# EAGLE design androino_2009-V1.0 (EAGLE 5.06)
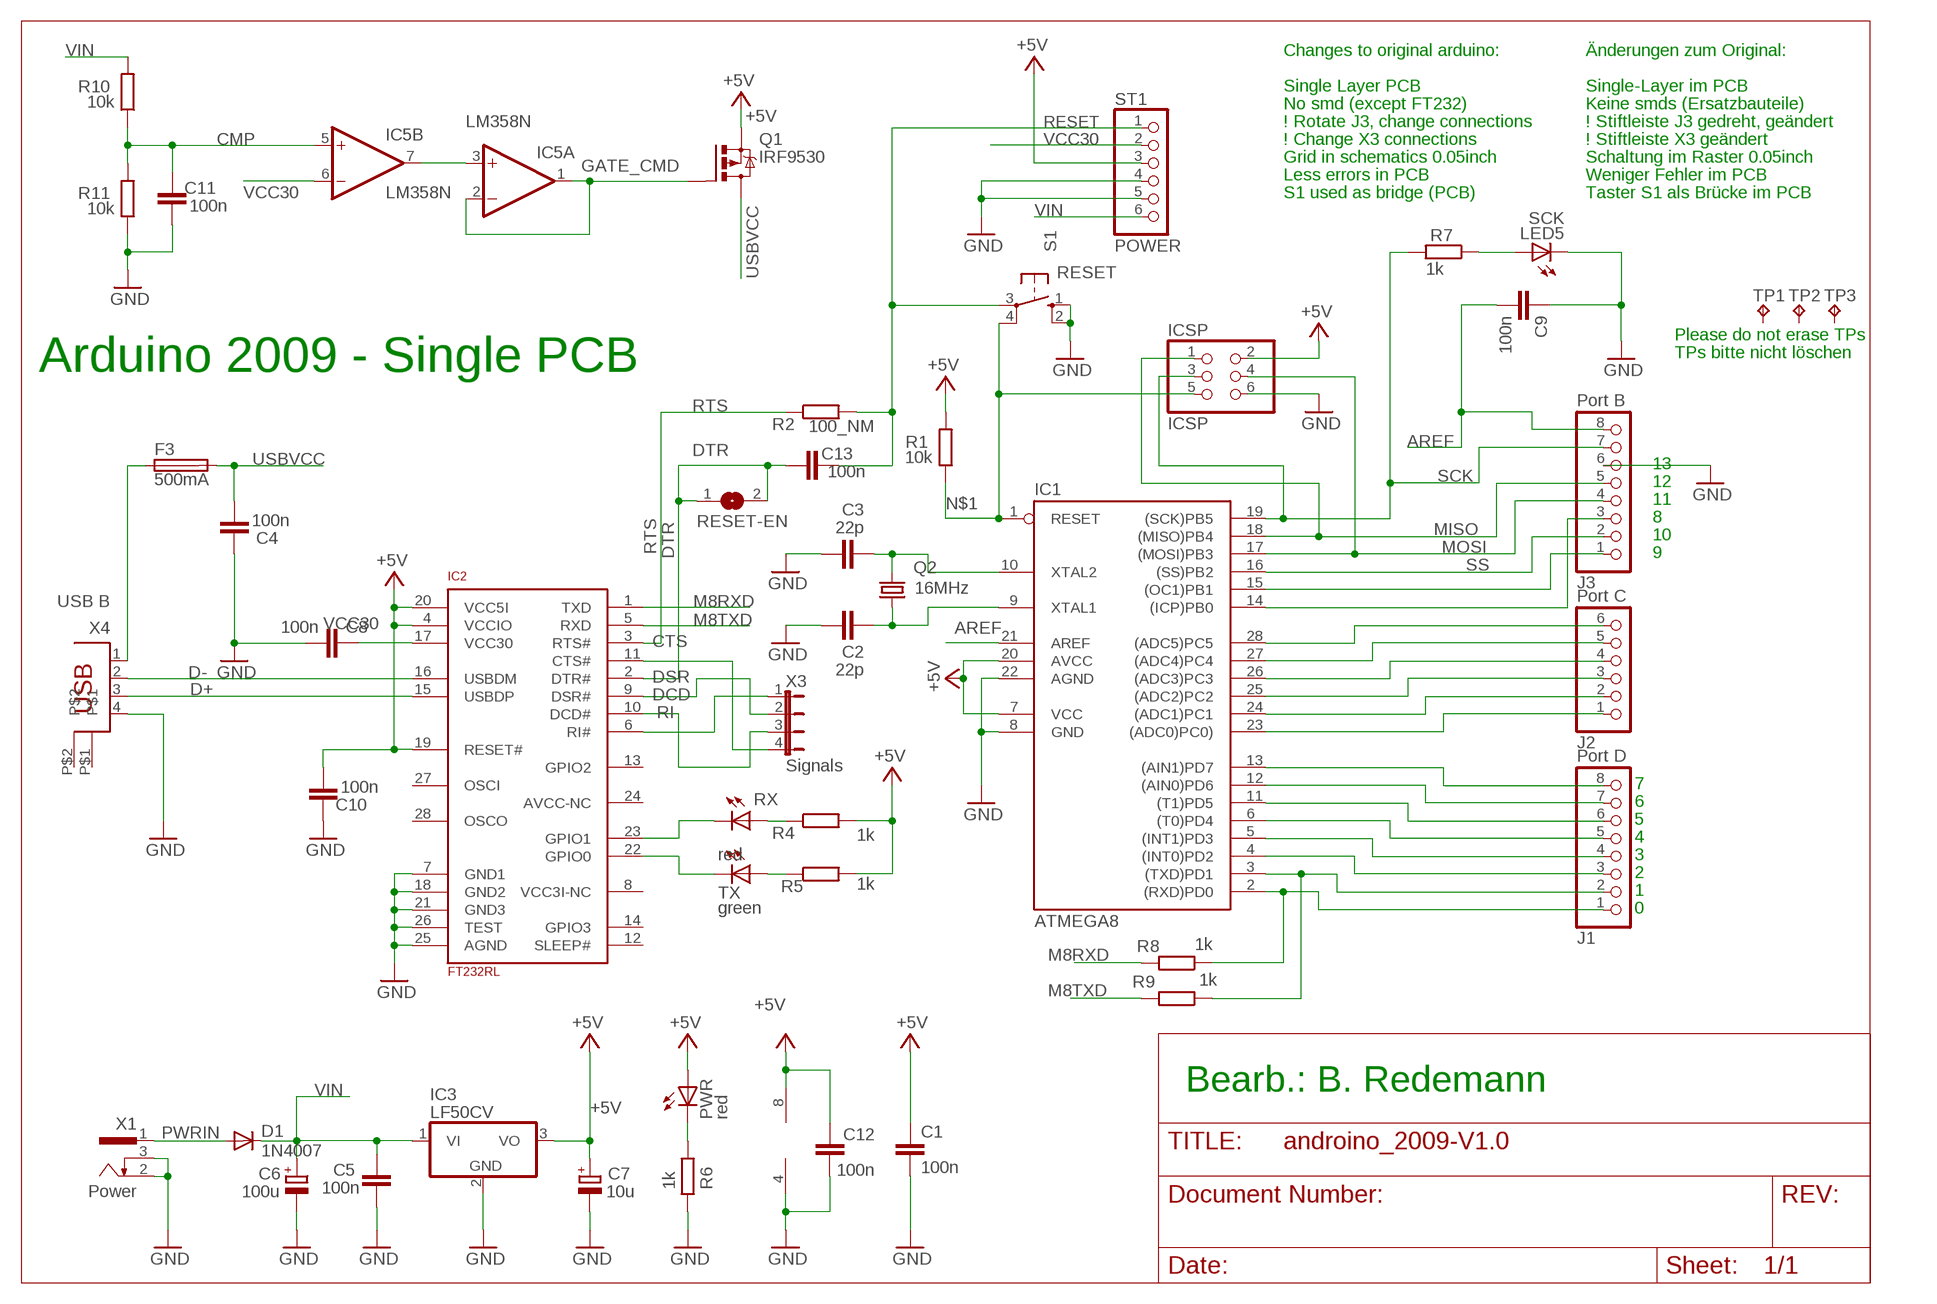
[diagram p0: schematic, sheet 1]

## Parts
C1  100n  C-EU025-024X044  [C025-024X044]
C2  22p  C-EU025-024X044  [C025-024X044]
C3  22p  C-EU025-024X044  [C025-024X044]
C4  100n  C-EU025-024X044  [C025-024X044]
C5  100n  C-EU025-024X044  [C025-024X044]
C6  100u  CPOL-EUE2.5-6  [E2,5-6]
C7  10u  CPOL-EUE2.5-6  [E2,5-6]
C8  100n  C-EU025-024X044  [C025-024X044]
C9  100n  C-EU025-024X044  [C025-024X044]
C10  100n  C-EU025-024X044  [C025-024X044]
C11  100n  C-EU025-024X044  [C025-024X044]
C12  100n  C-EU025-024X044  [C025-024X044]
C13  100n  C-EU025-024X044  [C025-024X044]
D1  1N4007  DIODE-D-7.5  [D-7.5]
F3  500mA  PICOFUSE  [PICOFUSE]
IC1  ATMEGA8  AT90S4433P  [DIL28-3]
IC2  FT232RL  [SSOP28]
IC3  LF50CV  7805TV  [TO220V]
IC5  LM358N  [DIL08]
ICSP  ICSP  PINHD-2X3  [2X03]
J1  Port D  PINHD-1X8  [1X08]
J2  Port C  PINHD-1X6  [1X06]
J3  Port B  PINHD-1X8  [1X08]
LED5  SCK  LED3MM  [LED3MM]
PWR  red  LED3MM  [LED3MM]
Q1  IRF9530  [TO220BV]
Q2  16MHz  CRYTALHC49S  [HC49/S]
R1  10k  R-EU_0204/7  [0204/7]
R2  100_NM  R-EU_0204/7  [0204/7]
R4  1k  R-EU_0204/7  [0204/7]
R5  1k  R-EU_0204/7  [0204/7]
R6  1k  R-EU_0204/7  [0204/7]
R7  1k  R-EU_0204/7  [0204/7]
R8  1k  R-EU_0204/7  [0204/7]
R9  1k  R-EU_0204/7  [0204/7]
R10  10k  R-EU_0204/7  [0204/7]
R11  10k  R-EU_0204/7  [0204/7]
RESET-EN  SJ  [SJ]
RX  red  LED3MM  [LED3MM]
S1  RESET  10-XX  [B3F-10XX]
ST1  POWER  PINHD-1X6  [1X06]
TP1  TPTP06SQ  [TP06SQ]
TP2  TPTP06SQ  [TP06SQ]
TP3  TPTP06SQ  [TP06SQ]
TX  green  LED3MM  [LED3MM]
X1  Power  733980-62  [733980-62]
X3  Signals  JP4E  [JP4]
X4  USB B  PN61729  [PN61729]

## Nets
+5V: C1.1 C7.+ C10.1 C12.2 IC1.7(VCC) IC1.20(AVCC) IC2.4(VCCIO) IC2.19(RESET#) IC2.20(VCC5I) IC3.3(VO) IC5.8(P:V+) ICSP.2 PWR.A Q1.S R1.2 R4.2 R5.2 ST1.3
AREF: C9.2 IC1.21(AREF) J3.8
CMP: C11.2 IC5.5(B:+IN) R10.1 R11.2
CTS: IC2.11(CTS#) X3.4
D+: IC2.15(USBDP) X4.3
D-: IC2.16(USBDM) X4.2
DCD: IC2.10(DCD#) X3.3
DSR: IC2.9(DSR#) X3.2
DTR: C13.1 IC2.2(DTR#) RESET-EN.1 RESET-EN.2
GATE_CMD: IC5.1(A:OUT) IC5.2(A:-IN) Q1.G
GND [gnd]: C1.2 C2.1 C3.1 C4.2 C5.1 C6.- C7.- C8.1 C9.1 C10.2 C11.1 C12.1 IC1.8(GND) IC1.22(AGND) IC2.7(GND1) IC2.18(GND2) IC2.21(GND3) IC2.25(AGND) IC2.26(TEST) IC3.2(GND) IC5.4(P:V-) ICSP.6 J3.6 LED5.K(C) R6.2 R11.1 S1.1(S) S1.2(S1) ST1.4 ST1.5 X1.2 X1.3 X4.4
M8RXD: IC2.1(TXD) R8.2
M8TXD: IC2.5(RXD) R9.2
MISO: IC1.18((MISO)PB4) ICSP.1 J3.5
MOSI: IC1.17((MOSI)PB3) ICSP.4 J3.4
N$1: IC1.1(RESET) ICSP.5 R1.1 S1.4(P1)
N$2: LED5.A R7.1
N$3: PWR.K(C) R6.1
N$6: C2.2 IC1.9(XTAL1) Q2.1
N$7: C3.2 IC1.10(XTAL2) Q2.2
N$8: F3.1 X4.1
N$16: IC1.23((ADC0)PC0)) J2.1
N$17: IC1.24((ADC1)PC1) J2.2
N$18: IC1.25((ADC2)PC2) J2.3
N$19: IC1.26((ADC3)PC3) J2.4
N$20: IC1.27((ADC4)PC4) J2.5
N$21: IC1.28((ADC5)PC5) J2.6
N$28: IC5.3(A:+IN) IC5.7(B:OUT)
N$32: IC2.23(GPIO1) RX.K(C)
N$34: IC2.22(GPIO0) TX.K(C)
N$35: R4.1 RX.A
N$36: R5.1 TX.A
PB0: IC1.14((ICP)PB0) J3.3
PB1: IC1.15((OC1)PB1) J3.1
PD0: IC1.2((RXD)PD0) J1.1 R8.1
PD1: IC1.3((TXD)PD1) J1.2 R9.1
PD2: IC1.4((INT0)PD2) J1.3
PD3: IC1.5((INT1)PD3) J1.4
PD4: IC1.6((T0)PD4) J1.5
PD5: IC1.11((T1)PD5) J1.6
PD6: IC1.12((AIN0)PD6) J1.7
PD7: IC1.13((AIN1)PD7) J1.8
PWRIN: D1.A X1.1
RESET: C13.2 R2.2 S1.3(P) ST1.1
RI: IC2.6(RI#) X3.1
RTS: IC2.3(RTS#) R2.1
SCK: IC1.19((SCK)PB5) ICSP.3 J3.7 R7.2
SS: IC1.16((SS)PB2) J3.2
USBVCC: C4.1 F3.2 Q1.D
VCC30: C8.2 IC2.17(VCC30) IC5.6(B:-IN) ST1.2
VIN: C5.2 C6.+ D1.C IC3.1(VI) R10.2 ST1.6
Unconnected: IC2.8(VCC3I-NC) IC2.12(SLEEP#) IC2.13(GPIO2) IC2.14(GPIO3) IC2.24(AVCC-NC) IC2.27(OSCI) IC2.28(OSCO) TP1.TP TP2.TP TP3.TP X4.P$1 X4.P$2

## Notes on the sheet
- Changes to original arduino: | Änderungen zum Original:
- Single Layer PCB | Single-Layer im PCB
- No smd (except FT232) | Keine smds (Ersatzbauteile)
- ! Rotate J3, change connections | ! Stiftleiste J3 gedreht, geändert
- ! Change X3 connections | ! Stiftleiste X3 geändert
- Grid in schematics 0.05inch | Schaltung im Raster 0.05inch
- Less errors in PCB | Weniger Fehler im PCB
- S1 used as bridge (PCB) | Taster S1 als Brücke im PCB
- Please do not erase TPs
- TPs bitte nicht löschen
- Arduino 2009 - Single PCB
- 13
- 12
- 11
- 8
- 10
- 9
- 7
- 6
- 5
- 4
- 3
- 2
- 1
- 0
- Bearb.: B. Redemann

## Library data of the parts
C1-C5 C8-C13 = rcl:C-EU: CAPACITOR, European symbol
C6 C7 = rcl:CPOL-EU: POLARIZED CAPACITOR, European symbol
D1 = diode:DIODE-: DIODE
F3 = fuse:PICOFUSE: PICOFUSE 19275, Wickmann
IC1 = atmel:AT90S4433: MICROCONTROLLER 4 Kbytes FLASH 128 bytes SRAM 256 bytes EEPROM UART 6-channel 10 bit ADC
IC2 = SmartPrj:FT232RL
IC3 = linear:78*: Positive VOLTAGE REGULATOR Source: http://cache.national.com/ds/LM/LM78L05.pdf http://www.fairchildsemi.com/ds/LM/LM7805.pdf
IC5 = linear:LM358: OP AMP also LM158; LM258; LM2904 Source: http://cache.national.com/ds/LM/LM158.pdf
ICSP = pinhead:PINHD-2X3: PIN HEADER
J1 J3 = pinhead:PINHD-1X8: PIN HEADER
J2 ST1 = pinhead:PINHD-1X6: PIN HEADER
LED5 PWR RX TX = led:LED: LED OSRAM: - CHIPLED LG R971, LG N971, LY N971, LG Q971, LY Q971, LO R971, LY R971 LH N974, LH R974 LS Q976, LO Q976, LY Q976 LO Q996 - Hyper CHIPLED LW Q18S LB Q993, LB Q99A, LB R99A - SideLED LS A670, LO A670, LY A670, LG A670, LP A670 LB A673, LV A673, LT A673, LW A673 LH A674 LY A675 LS A676, LA A676, LO A676, LY A676, LW A676 LS A679, LY A679, LG A679 - Hyper Micro SIDELED® LS Y876, LA Y876, LO Y876, LY Y876 LT Y87S - SmartLED LW L88C, LW L88S LB L89C, LB L89S, LG L890 LS L89K, LO L89K, LY L89K LS L896, LA L896, LO L896, LY L896 - TOPLED LS T670, LO T670, LY T670, LG T670, LP T670 LSG T670, LSP T670, LSY T670, LOP T670, LYG T670 LG T671, LOG T671, LSG T671 LB T673, LV T673, LT T673, LW T673 LH T674 LS T676, LA T676, LO T676, LY T676, LB T676, LH T676, LSB T676, LW T676 LB T67C, LV T67C, LT T67C, LS T67K, LO T67K, LY T67K, LW E67C LS E67B, LA E67B, LO E67B, LY E67B, LB E67C, LV E67C, LT E67C LW T67C LS T679, LY T679, LG T679 LS T770, LO T770, LY T770, LG T770, LP T770 LB T773, LV T773, LT T773, LW T773 LH T774 LS E675, LA E675, LY E675, LS T675 LS T776, LA T776, LO T776, LY T776, LB T776 LHGB T686 LT T68C, LB T68C - Hyper Mini TOPLED® LB M676 - Mini TOPLED Santana® LG M470 LS M47K, LO M47K, LY M47K Source: http://www.osram.convergy.de/
Q1 = transistor-power:IRF9530: P-CHANNEL HEXFET POWER-MOS-FET Source: http://www.irf.com/product-info/datasheets/data/irf9530.pdf
Q2 = crystal:CRYTAL: CRYSTAL
R1 R2 R4-R11 = rcl:R-EU_: RESISTOR, European symbol
RESET-EN = jumper:SJ: SMD solder JUMPER
S1 = switch-omron:10-XX: OMRON SWITCH
TP1-TP3 = testpad:TP: Test pad
X1 = con-conrad:73398?: FEMALE PRINT CONNECTOR Niedervolt-Steckverbinder Distributor Conrad
X3 = jumper:JP4E: JUMPER
X4 = SmartPrj:PN61729: BERG USB connector

## Net classes
0 default: width 0.254 mm, drill 0.305 mm, clearance 0.152 mm
1 power: width 0.61 mm, drill 0.508 mm, clearance 0.152 mm
2 gnd: width 0.305 mm, drill 0.508 mm, clearance 0.152 mm
3 usbvcc: width 0.508 mm, drill 0.508 mm, clearance 0.152 mm
4 aref: width 0.406 mm

## Board
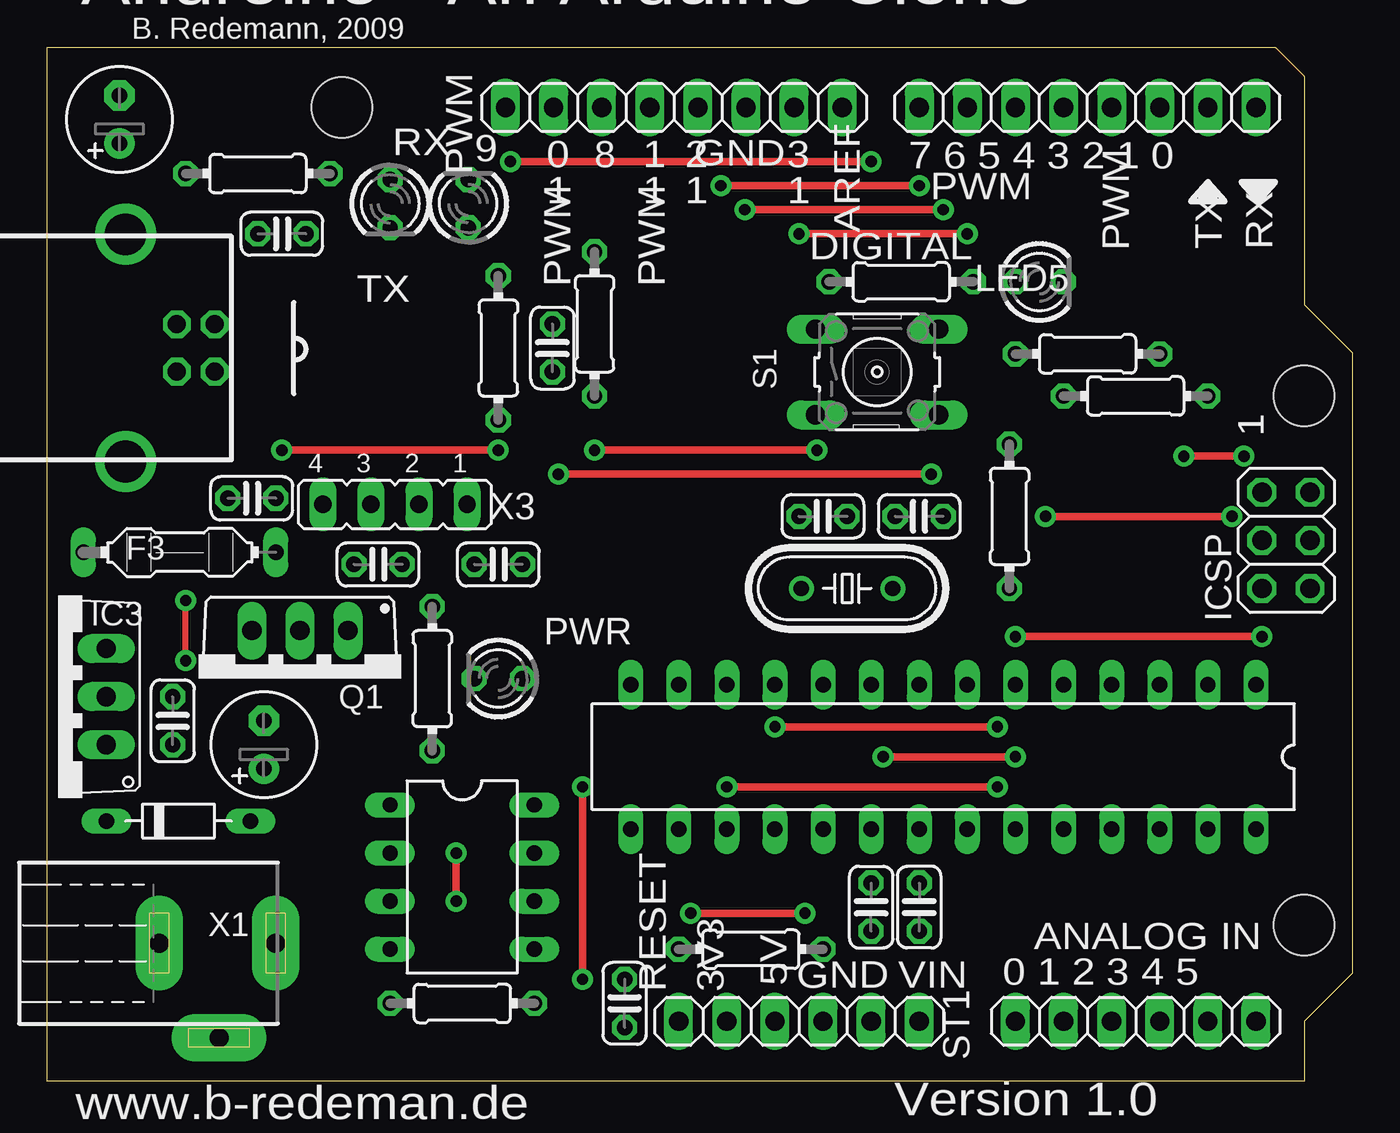
[diagram p1: board, top side]
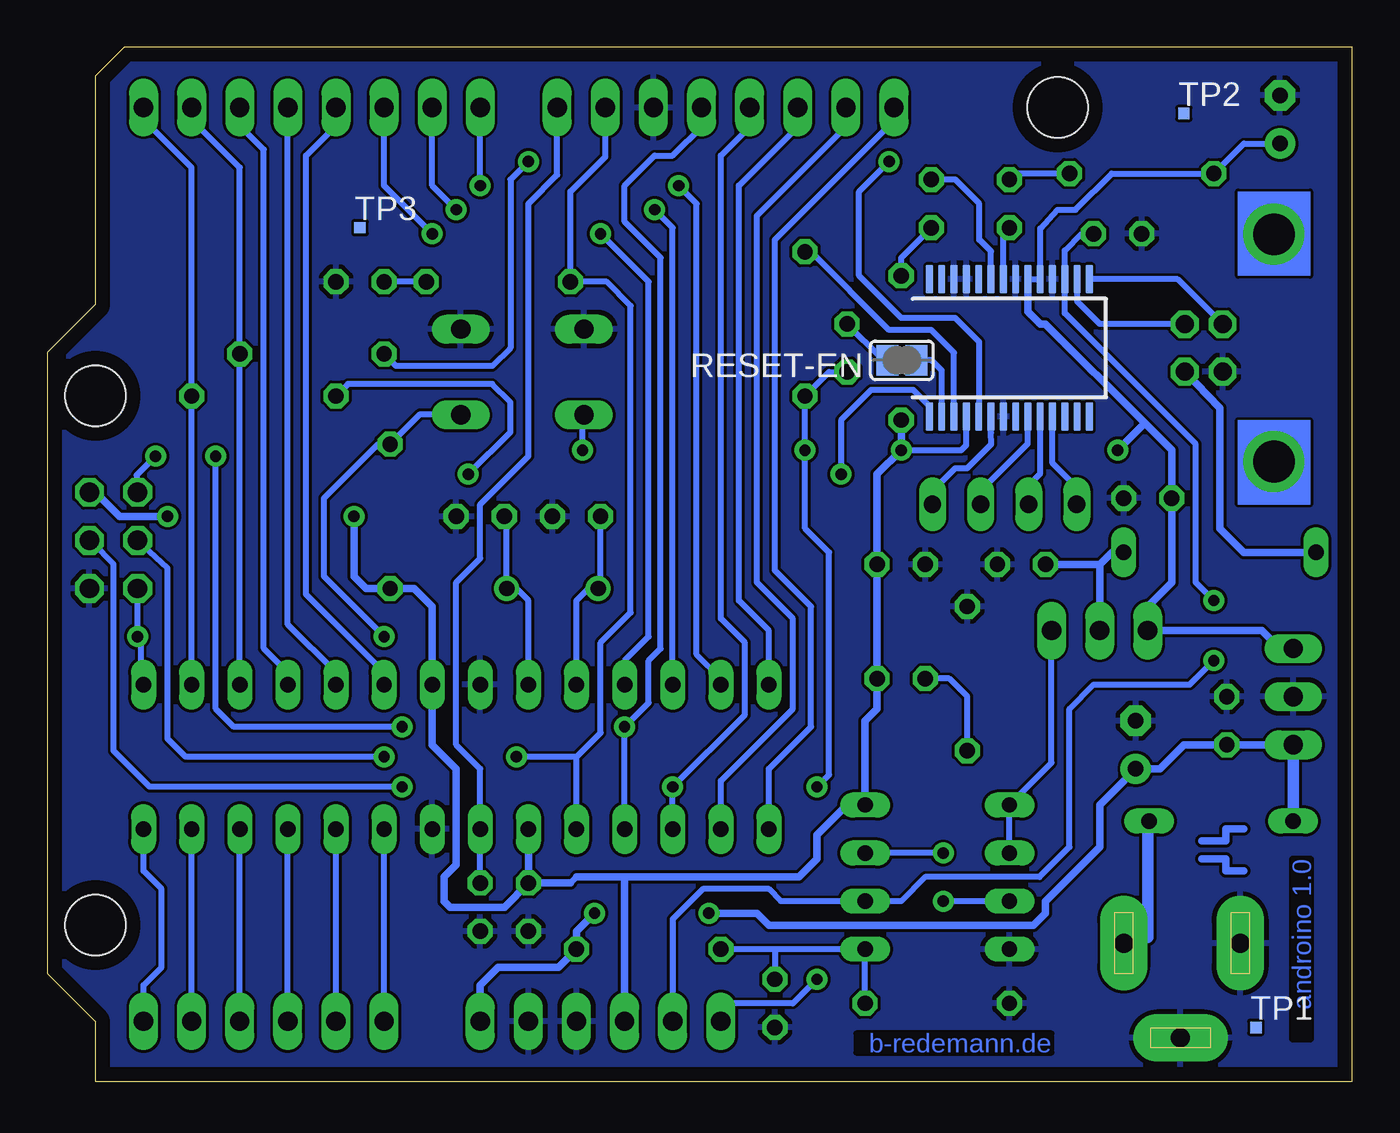
[diagram p2: board, bottom side, seen from below]

Size 68.9 x 54.61 mm. Coordinates in mm from the lower left corner, seen from the top.
Outline: 0,54.61 64.83,54.61 66.36,53.09 66.36,41.02 68.9,38.48 68.9,5.71 66.36,3.17 66.36,0 0,0 0,54.61
Copper layers (1*16): Top 0.035mm / dielectric 1.5mm / Bottom 0.035mm
Design rules "default *": minimum track width 6mil, minimum drill 12mil, track to track 6mil, track to pad 6mil, pad to pad 6mil, via to via 6mil, smd to smd 6mil, copper to edge 30mil, drill to drill 6mil, minimum pad ring 10mil, minimum via ring 10mil, stop-mask expansion 4mil, vias tented up to drill 0mil, thermal gap 10mil
Holes 3.2 mm at 66.36,36.2 66.36,8.26 15.56,51.43

### Footprints (pad centres in the part's own frame; a part is rotated, then mirrored left to right if it is on the bottom)
C025-024X044 = drill 0.813 octagon: 1 -1.27,0; 2 1.27,0
E2,5-6 = drill 0.813 pad 1.6 round: + -1.27,0 | drill 0.813 pad 1.6 octagon: - 1.27,0
D-7.5 = drill 0.813 long: A 3.81,0; C -3.81,0
PICOFUSE = drill 0.813 long: 1 -5.08,0; 2 5.08,0
DIL28-3 = drill 0.813 long: 1 -16.51,-3.81; 2 -13.97,-3.81; 3 -11.43,-3.81; 4 -8.89,-3.81; 5 -6.35,-3.81; 6 -3.81,-3.81; 7 -1.27,-3.81; 8 1.27,-3.81; 9 3.81,-3.81; 10 6.35,-3.81; 11 8.89,-3.81; 12 11.43,-3.81; 13 13.97,-3.81; 14 16.51,-3.81; 15 16.51,3.81; 16 13.97,3.81; 17 11.43,3.81; 18 8.89,3.81; 19 6.35,3.81; 20 3.81,3.81; 21 1.27,3.81; 22 -1.27,3.81; 23 -3.81,3.81; 24 -6.35,3.81; 25 -8.89,3.81; 26 -11.43,3.81; 27 -13.97,3.81; 28 -16.51,3.81
SSOP28 = smd 0.381 x 1.499: 1 -4.225,-3.625; 2 -3.575,-3.625; 3 -2.925,-3.625; 4 -2.275,-3.625; 5 -1.625,-3.625; 6 -0.975,-3.625; 7 -0.325,-3.625; 8 0.325,-3.625; 9 0.975,-3.625; 10 1.625,-3.625; 11 2.275,-3.625; 12 2.925,-3.625; 13 3.575,-3.625; 14 4.225,-3.625; 15 4.225,3.625; 16 3.575,3.625; 17 2.925,3.625; 18 2.275,3.625; 19 1.625,3.625; 20 0.975,3.625; 21 0.325,3.625; 22 -0.325,3.625; 23 -0.975,3.625; 24 -1.625,3.625; 25 -2.275,3.625; 26 -2.925,3.625; 27 -3.575,3.625; 28 -4.225,3.625
TO220V = drill 1.016 long: 1 -2.54,-2.54; 2 0,-2.54; 3 2.54,-2.54
DIL08 = drill 0.813 long: 1 -3.81,-3.81; 2 -1.27,-3.81; 3 1.27,-3.81; 4 3.81,-3.81; 5 3.81,3.81; 6 1.27,3.81; 7 -1.27,3.81; 8 -3.81,3.81
2X03 = drill 1.016 octagon: 1 -2.54,-1.27; 2 -2.54,1.27; 3 0,-1.27; 4 0,1.27; 5 2.54,-1.27; 6 2.54,1.27
1X08 = drill 1.016 long: 1 -8.89,0; 2 -6.35,0; 3 -3.81,0; 4 -1.27,0; 5 1.27,0; 6 3.81,0; 7 6.35,0; 8 8.89,0
1X06 = drill 1.016 long: 1 -6.35,0; 2 -3.81,0; 3 -1.27,0; 4 1.27,0; 5 3.81,0; 6 6.35,0
LED3MM = drill 0.813 octagon: A -1.27,0; K 1.27,0
TO220BV = drill 1.016 long: D 0,-2.54; G -2.54,-2.54; S 2.54,-2.54
HC49/S = drill 0.813 round: 1 -2.413,0; 2 2.413,0
0204/7 = drill 0.813 octagon: 1 -3.81,0; 2 3.81,0
SJ = smd 1.168 x 1.6: 1 -0.762,0; 2 0.762,0
B3F-10XX = drill 1.016 long: 1 -3.251,2.261; 2 3.251,2.261; 3 -3.251,-2.261; 4 3.251,-2.261
TP06SQ = smd 0.6 x 0.6: TP 0,0
733980-62 = drill 1 pad 2.5 long: 1 0,8.57; 2 0,2.42; 3 5,5.57
JP4 = drill 0.914 long: 1 -3.81,0; 2 -1.27,0; 3 1.27,0; 4 3.81,0
PN61729 = drill 0.95 octagon: 1 1.25,4.71; 2 -1.25,4.71; 3 -1.25,2.71; 4 1.25,2.71 | drill 2.2 round: P$1 -6,0; P$2 6,0

### Placement (x,y rotation side)
C1  43.5,9.21 270 top
C2  46.04,29.85 180 top
C3  40.96,29.85 180 top
C4  17.46,27.31 0 top
C5  6.62,19.05 270 top
C6  11.43,17.78 90 top
C7  3.81,50.8 90 top
C8  12.38,44.77 0 top
C9  46.04,9.21 90 top
C10  10.79,30.8 0 top
C11  30.48,4.13 90 top
C12  23.81,27.31 0 top
C13  26.67,38.73 270 top
D1  6.92,13.75 0 top
F3  6.99,27.94 0 top
IC1  47.31,17.15 180 top
IC2  18.1,38.73 0 bottom
IC3  0.57,20.32 90 top
IC5  21.91,10.79 270 top
ICSP  65.41,28.58 270 top
J1  54.93,51.43 180 top
J2  57.47,3.17 0 top
J3  33.08,51.43 0 top
LED5  52.39,42.23 0 top
PWR  23.81,21.27 180 top
Q1  13.34,21.27 180 top
Q2  42.23,26.04 180 top
R1  50.8,29.85 270 top
R2  28.89,40 270 top
R4  23.81,38.73 270 top
R5  11.11,47.94 180 top
R6  20.32,21.27 90 top
R7  45.09,42.23 180 top
R8  57.47,36.2 180 top
R9  54.93,38.42 180 top
R10  37.15,6.98 0 top
R11  21.91,4.13 0 top
RESET-EN  23.77,38.09 0 bottom
RX  22.22,46.35 90 top
S1  43.82,37.46 0 top
ST1  39.69,3.17 0 top
TP1  5.08,2.86 0 bottom
TP2  8.89,51.12 0 bottom
TP3  52.39,45.09 0 bottom
TX  18.1,46.35 270 top
X1  3.49,7.3 270 top
X3  18.35,30.48 180 top
X4  4.13,38.73 270 top

### Tracks (layer width: path | path; a pad name or v marks a point on that pad's centre or on a via)
+5V  (via drill 0.6)
  Top 0.406: v52.71,29.85 v62.55,29.85 | v12.38,33.34 v23.81,33.34
  Bottom 0.305: 40.96,10.79 41.28,10.48 | IC2.20 IC2.19 16.47,45.05 15.56,46.04 14.6,46.04 12.7,47.94 R5.2 5.71,49.53 C7.+ | IC2.4 20.37,33.6 20.64,33.34 v23.81,33.34 | v12.38,33.34
  Bottom 0.406: C1.1 IC1.20 | 38.42,10.79 29.21,10.79 28.26,11.75 28.26,13.02 26.67,14.61 IC5.8 25.72,19.05 25.08,19.69 PWR.A C12.2 25.08,32.07 v23.81,33.34 R4.2 | 38.42,10.79 40.96,10.79 | 41.28,10.48 C1.1 | 38.42,10.79 ST1.3 | IC2.20 17.12,40.66 16.47,40 16.19,40 10.95,34.77 | IC3.3 3.81,22.86 4.76,23.81 Q1.S 10.79,25.08 9.52,26.35 C10.1 9.52,33.34 10.95,34.77 | ICSP.2 66.31,31.07 65.09,29.85 v62.55,29.85 | v52.71,29.85 52.71,26.67 52.07,26.04 R1.2 49.53,26.04 48.58,25.08 IC1.7 48.58,17.78 47.31,16.51 47.31,11.43 47.94,10.79 47.94,9.53 47.62,9.21 44.77,9.21 C1.1 | 10.95,34.77 v12.38,33.34
AREF
  Bottom 0.305: C9.2 IC1.21 46.04,16.51 47.31,17.78 47.31,26.35 46.04,27.62 46.04,30.48 43.5,33.02 43.5,46.35 41.97,47.88 J3.8
CMP
  Bottom 0.305: R11.2 IC5.5 30.48,6.98 | 30.48,6.98 R10.1 | 30.48,6.98 C11.2
CTS
  Bottom 0.305: IC2.11 15.82,32.65 14.6,31.43 14.6,30.54 X3.4
D+
  Bottom 0.305: X4.3 9.21,42.36 IC2.15
D-
  Bottom 0.305: IC2.16 14.52,41.19 13.34,40 9.77,40 X4.2
DCD
  Bottom 0.305: IC2.10 16.47,32.1 17.08,31.5 X3.3
DSR
  Bottom 0.305: IC2.9 17.12,33.68 19.68,31.12 19.68,30.54 X3.2
DTR
  Bottom 0.305: IC2.2 21.67,37.55 22.22,38.1 23.32,38.1 RESET-EN.2 RESET-EN.1 24.85,38.19 C13.1
GATE_CMD
  Bottom 0.305: IC5.2 IC5.1 15.87,16.83 Q1.G
GND
  pour Bottom: 0.32,54.61 68.9,54.61 68.26,0 -0.32,0
M8RXD  (via drill 0.6)
  Top 0.406: v26.99,32.07 v46.67,32.07
  Bottom 0.305: IC2.1 22.32,35.66 23.18,36.51 25.4,36.51 26.99,34.92 v26.99,32.07 | R8.2 53.02,36.83 45.4,36.83 44.45,35.88 44.45,34.29 v46.67,32.07
M8TXD  (via drill 0.6)
  Top 0.406: v24.45,48.58 v43.5,48.58
  Bottom 0.305: IC2.5 19.68,35.15 19.68,39.05 20.95,40.32 23.81,40.32 26.04,42.54 26.04,46.99 v24.45,48.58 | R9.2 50.48,37.78 45.4,37.78 44.45,38.73 44.45,47.62 v43.5,48.58
MISO  (via drill 0.6)
  Top 0.406: v38.42,18.73 v50.16,18.73 | v60.01,33.02 v63.18,33.02
  Bottom 0.305: ICSP.1 64.18,32.02 v63.18,33.02 | IC1.18 v38.42,18.73 37.15,20 37.15,22.23 36.51,22.86 36.51,43.5 38.42,45.4 38.42,47.31 36.83,48.89 35.88,48.89 34.29,50.48 J3.5 | v50.16,18.73 59.05,18.73 60.01,19.69 v60.01,33.02
MOSI  (via drill 0.6)
  Top 0.406: v35.88,15.56 v50.16,15.56
  Bottom 0.305: J3.4 31.75,51.37 31.75,50.48 33.34,48.89 33.34,24.45 32.07,23.18 32.07,19.37 v35.88,15.56 IC1.17 | ICSP.4 66.5,28.44 65.41,27.31 65.41,17.46 63.5,15.56 v50.16,15.56
N$1  (via drill 0.6)
  Top 0.406: v51.12,23.5 v64.14,23.5
  Bottom 0.305: 63.96,20.78 IC1.1 | 63.96,20.78 63.97,21.11 | 63.96,20.78 63.96,23.04 v64.14,23.5 ICSP.5 | v51.12,23.5 54.29,26.67 54.29,30.8 51.43,33.66 R1.1 49.21,35.24 47.42,35.24 S1.4
N$2
  Bottom 0.305: R7.1 LED5.A
N$3
  Bottom 0.305: PWR.K 21.27,21.27 20.32,20.32 R6.1
N$4
  Bottom 0.406: 5.71,13.33 6.67,13.33 6.67,12.7 7.94,12.7
N$6
  Bottom 0.305: IC1.9 43.5,25.4 44.13,26.04 Q2.1 44.64,29.72 C2.2
N$7
  Bottom 0.305: IC1.10 40.96,25.4 40.32,26.04 Q2.2 39.69,26.16 C3.2
N$8
  Bottom 0.406: X4.1 6.99,35.56 6.99,29.21 5.71,27.94 F3.1
N$9
  Bottom 0.406: 5.71,11.11 6.67,11.11 6.67,11.75 7.94,11.75
N$16
  Bottom 0.305: J2.1 IC1.23
N$17
  Bottom 0.305: J2.2 IC1.24
N$18
  Bottom 0.305: J2.3 IC1.25
N$19
  Bottom 0.305: J2.4 IC1.26
N$20
  Bottom 0.305: J2.5 IC1.27
N$21
  Bottom 0.305: J2.6 63.82,5.08 62.86,6.03 62.86,10.16 63.82,11.11 IC1.28
N$28  (via drill 0.6)
  Top 0.406: v21.59,9.53 v21.59,12.06
  Bottom 0.305: IC5.3 v21.59,9.53 | v21.59,12.06 IC5.7
N$32
  Bottom 0.305: IC2.23 19.07,43.84 19.68,44.45 19.68,46.35 20.95,47.62 RX.K
N$34
  Bottom 0.305: IC2.22 18.42,44.76 TX.K
N$35
  Bottom 0.305: RX.A 23.81,43.5 R4.1
N$36
  Bottom 0.305: R5.1 17.78,47.94 TX.A
PB0
  Bottom 0.305: IC1.14 30.8,23.81 32.39,25.4 32.39,47.31 29.21,50.48 29.21,51.37 J3.3
PB1
  Bottom 0.305: IC1.15 30.8,16.51 28.58,18.73 28.58,25.08 30.48,26.99 30.48,44.45 24.13,50.8 24.13,51.37 J3.1
PD0
  Bottom 0.305: IC1.2 R8.1 61.28,48.26 63.82,50.8 J1.1
PD1
  Bottom 0.305: IC1.3 R9.1 58.74,48.26 61.28,50.8 J1.2
PD2
  Bottom 0.305: IC1.4 56.2,21.59 57.47,22.86 57.47,49.21 58.74,50.48 J1.3
PD3
  Bottom 0.305: IC1.5 53.66,21.59 56.2,24.13 J1.4
PD4
  Bottom 0.305: IC1.6 51.12,21.59 55.25,25.72 55.25,48.89 53.66,50.48 J1.5
PD5  (via drill 0.6)
  Top 0.406: v39.69,44.77 v48.58,44.77
  Bottom 0.305: IC1.11 38.42,22.23 37.15,23.5 37.15,42.23 v39.69,44.77 | v48.58,44.77 51.12,47.31 J1.6 51.12,51.75
PD6  (via drill 0.6)
  Top 0.406: v36.83,46.04 v47.31,46.04
  Bottom 0.305: IC1.12 35.88,45.09 v36.83,46.04 | v47.31,46.04 48.58,47.31 J1.7
PD7  (via drill 0.6)
  Top 0.406: v35.56,47.31 v46.04,47.31
  Bottom 0.305: IC1.13 33.34,21.27 34.61,22.54 34.61,46.35 v35.56,47.31 | v46.04,47.31 J1.8
PWRIN
  Bottom 0.61: D1.A 10.79,13.06 10.79,8.56 10.78,7.62 X1.1
RESET  (via drill 0.6)
  Top 0.406: v28.89,33.34 v40.64,33.34 | v28.26,5.4 v28.26,15.56
  Bottom 0.305: C13.2 27.62,37.46 R2.2 v28.89,33.34 28.89,29.21 27.62,27.94 27.62,16.19 v28.26,15.56 | v40.64,33.34 40.64,35.24 S1.3 | ST1.1 33.34,4.13 29.53,4.13 v28.26,5.4
RI
  Bottom 0.305: IC2.6 19.07,34.27 19.05,33.66 20.32,32.38 20.95,32.38 22.22,31.12 22.16,30.86 X3.1
RTS
  Bottom 0.305: IC2.3 21.02,38.48 22.22,39.69 24.45,39.69 28.58,43.81 R2.1
SCK  (via drill 0.6)
  Top 0.406: v44.13,17.15 v51.12,17.15
  Bottom 0.305: IC1.19 40.96,17.15 | v51.12,17.15 61.6,17.15 62.55,18.1 62.55,27.12 ICSP.3 | 40.96,17.15 v44.13,17.15 | 40.96,17.15 39.69,18.42 39.69,23.18 38.1,24.77 38.1,40.96 39.37,42.23 R7.2 41.28,46.99 39.43,48.83 J3.7
SS
  Bottom 0.305: IC1.16 33.34,15.88 29.53,19.69 29.53,24.45 31.43,26.35 31.43,45.72 26.67,50.48 26.67,51.37 J3.2
USBVCC
  Bottom 0.406: F3.2 12.7,27.94 13.34,27.31 | 13.34,27.31 Q1.D | 13.34,27.31 C4.1
VCC30  (via drill 0.6)
  Top 0.305: v7.3,22.23 v7.3,25.4
  Bottom 0.305: C8.2 14.29,44.77 15.17,43.88 IC2.17 15.17,40.57 8.26,33.66 8.26,26.35 v7.3,25.4 | v7.3,22.23 8.57,20.96 13.65,20.96 14.92,19.69 14.92,12.38 16.51,10.79 22.54,10.79 23.81,9.53 IC5.6 30.16,9.53 30.8,10.16 34.29,10.16 35.88,8.57 ST1.2
VIN  (via drill 0.6)
  Top 0.406: v33.97,8.89 v40.01,8.89
  Bottom 0.406: ST1.6 46.04,5.08 45.08,6.03 41.91,6.03 R10.2 40.96,7.94 v40.01,8.89 | IC3.1 C5.2 8.89,17.78 10.16,16.51 C6.+ 13.34,14.61 13.34,12.38 16.19,9.53 16.19,8.89 16.83,8.26 30.8,8.26 31.43,8.89 v33.97,8.89
  Bottom 0.61: D1.C IC3.1
(copper drawn outside any net)
  shapes: Bottom area x2

### Text on the board
Bottom: androino 1.0 | b-redemann.de
tNames: Androino - An Arduino Clone | B. Redemann, 2009 | PWM | GND | RX | 9 | 0 | 8 | 1 | 2 | 3 | 7 6 5 4 3 2 1 0 | PWM | 1 | 1 | 1 | 1 | AREF | DIGITAL | PWM | TX | RX | TX | PWM | PWM | 1 | GND | VIN | ANALOG IN | RESET | 3V3 | 5V | 0 1 2 3 4 5 | Version 1.0 | www.b-redeman.de